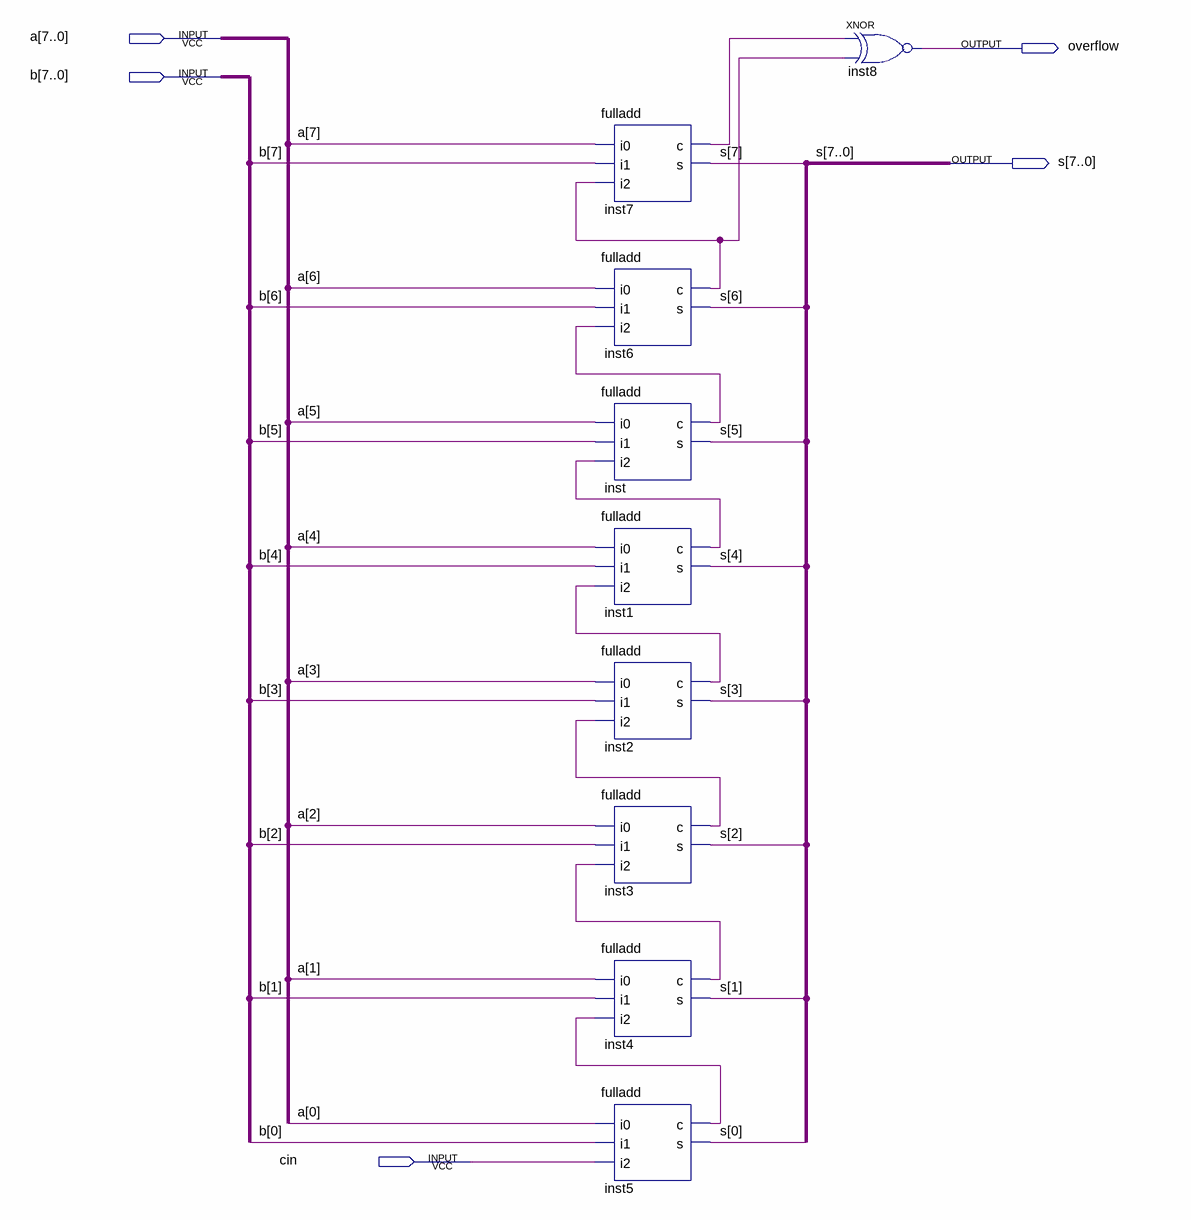
[diagram p0: schematic sheet]
// Quartus schematic rippleadder.bdf as structural Verilog: 9 symbols, 5 pins
module rippleadder (
  input  [7:0] a,
  input  [7:0] b,
  input  cin,
  output overflow,
  output [7:0] s
);

  wire inst1_c, inst2_c, inst3_c, inst4_c, inst5_c, inst6_c, inst7_c, inst_c;

  fulladd inst7 (.i0(a[7]), .i1(b[7]), .i2(inst6_c), .c(inst7_c), .s(s[7]));
  fulladd inst6 (.i0(a[6]), .i1(b[6]), .i2(inst_c), .c(inst6_c), .s(s[6]));
  fulladd inst (.i0(a[5]), .i1(b[5]), .i2(inst1_c), .c(inst_c), .s(s[5]));
  fulladd inst1 (.i0(a[4]), .i1(b[4]), .i2(inst2_c), .c(inst1_c), .s(s[4]));
  fulladd inst2 (.i0(a[3]), .i1(b[3]), .i2(inst3_c), .c(inst2_c), .s(s[3]));
  fulladd inst3 (.i0(a[2]), .i1(b[2]), .i2(inst4_c), .c(inst3_c), .s(s[2]));
  fulladd inst4 (.i0(a[1]), .i1(b[1]), .i2(inst5_c), .c(inst4_c), .s(s[1]));
  fulladd inst5 (.i0(a[0]), .i1(b[0]), .i2(cin), .c(inst5_c), .s(s[0]));
  xnor inst8 (overflow, inst7_c, inst6_c);
endmodule
